# EAGLE design attiniest85-batty-shield-mk-2.2 (EAGLE 6.5.0)
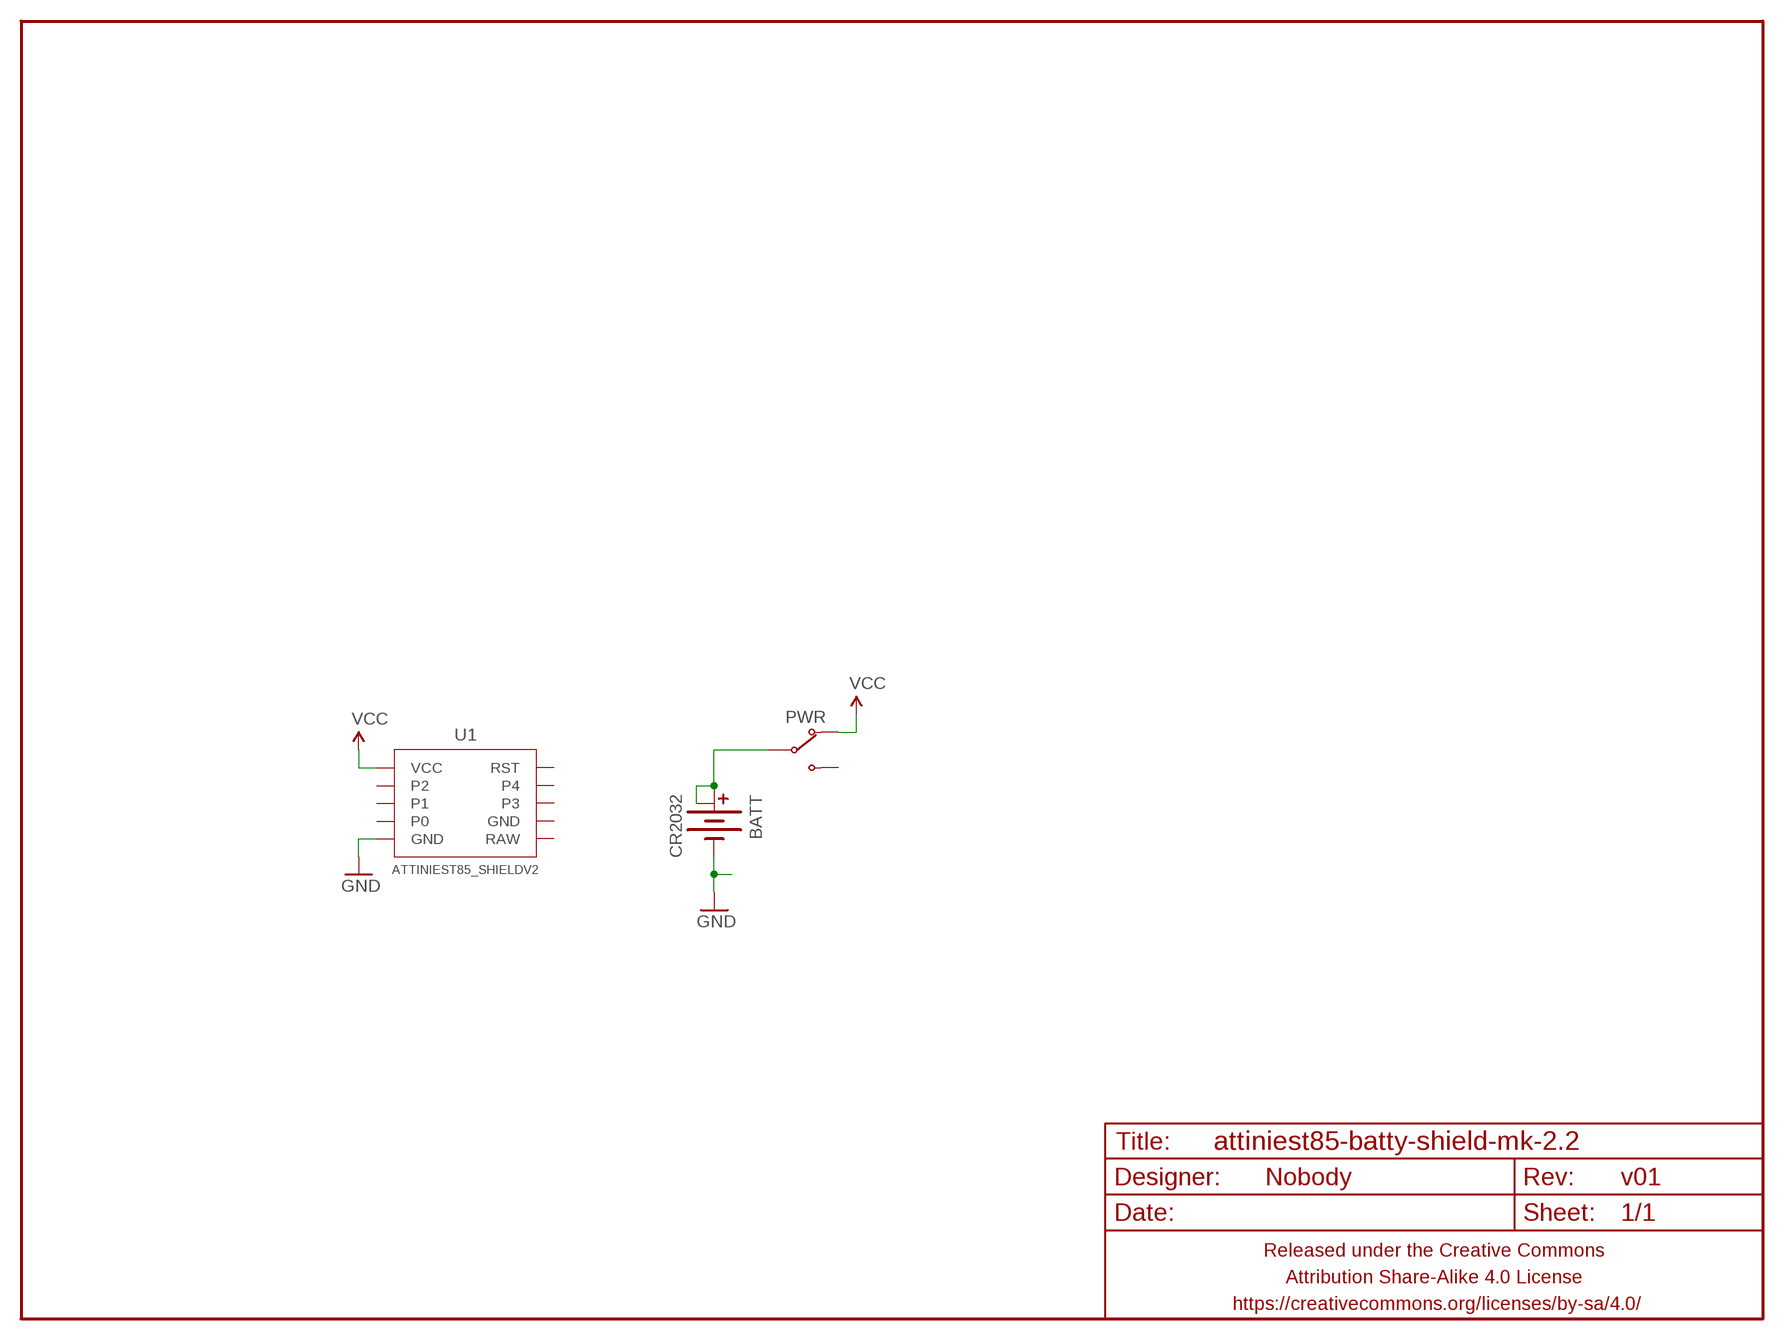
[diagram p0: schematic, sheet 1]

## Parts
BATT  CR2032  BATTERY-COINCR2032_SMD  [BATTCON_20MM_MINE]
FRAME1  FRAME-LETTERNO_PACKAGE  [DUMMY]
PWR  SWITCH-SPDTPTH-RA-2MM  [SPDT-RA-2MM]
U1  ATTINIEST85_SHIELDV2  [ATTINIEST85_SHIELD_V2]

## Nets
GND: BATT.BOTTOM(-) U1.GND@2(GND)
N$1: BATT.TOP@1(+) BATT.TOP@2(+1) PWR.2(COM)
VCC: PWR.1(NC) U1.VCC
Unconnected: PWR.3(NO) U1.0 U1.1 U1.2 U1.3 U1.4 U1.GND@1(GND) U1.RAW U1.RST

## Library data of the parts
BATT = A_butts:BATTERY-COIN
FRAME1 = A_butts:FRAME-LETTER: Schematic Frame Standard 8.5x11 US Letter frame; DESIGNER: Nobody; VERSION: v01
PWR = A_butts:SWITCH-SPDT
U1 = A_butts:ATTINIEST85_SHIELD

## Board
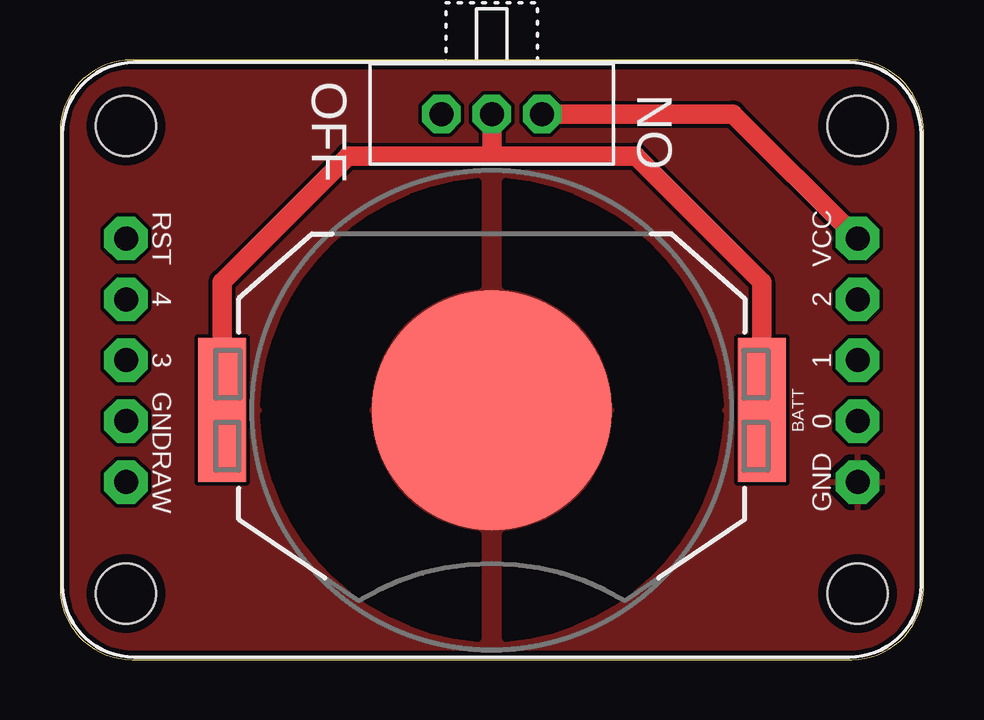
[diagram p1: board, top side]
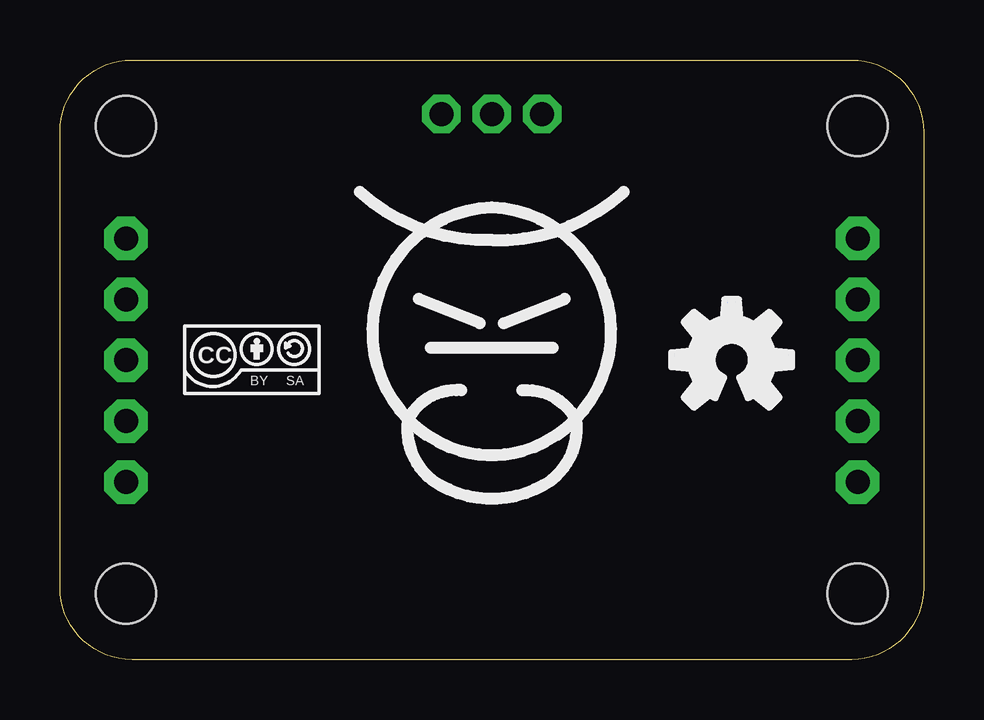
[diagram p2: board, bottom side, seen from below]

Size 36 x 25 mm. Coordinates in mm from the lower left corner, seen from the top.
Outline: 0,22 0,3 arc90 3,0 33,0 arc90 36,3 36,22 arc90 33,25 3,25 arc90 0,22
Copper layers (1*16): Top 0.0356mm / dielectric 1.5011mm / Bottom 0.0356mm
Design rules "LaenPCBOrder_2": minimum track width 6mil, minimum drill 13mil, track to track 6mil, track to pad 6mil, pad to pad 6mil, via to via 6mil, smd to smd 6mil, copper to edge 15mil, drill to drill 6mil, minimum pad ring 7mil, minimum via ring 7mil, stop-mask expansion 3mil, vias tented up to drill 20mil, thermal gap 10mil

### Footprints (pad centres in the part's own frame; a part is rotated, then mirrored left to right if it is on the bottom)
BATTCON_20MM_MINE = smd 10 x 10: BOTTOM 0,0 | smd 6 x 2: TOP@1 0,11.25; TOP@2 0,-11.25
SPDT-RA-2MM = drill 1 pad 1.6 octagon: 1 -2.1,0; 2 0,0; 3 2.1,0
ATTINIEST85_SHIELD_V2 = drill 1 pad 1.8 octagon: 0 15.25,-2.56; 1 15.25,-0.02; 2 15.25,2.52; 3 -15.25,-0.02; 4 -15.25,2.52; GND@1 -15.25,-2.56; GND@2 15.25,-5.1; RAW -15.25,-5.1; RST -15.25,5.06; VCC 15.25,5.06 | hole 2.5: -15.25,-9.75; -15.25,9.75; 15.25,9.75; 15.25,-9.75

### Placement (x,y rotation side)
BATT  18,10.4 270 top
FRAME1  0,0 0 top
PWR  18,22.75 180 top
U1  18,12.5 0 top
U$3  [CC-BY-SA-4.0-NO-URL]  28,12.5 0 bottom
U$4  [OSHWLOGO_TOP_0.2]  8,12.5 0 bottom
U$6  [COW_METAL]  18,12.5 0 bottom

### Tracks (layer width: path | path; a pad name or v marks a point on that pad's centre or on a via)
GND
  pour Top: -0.1,-0.1 -0.1,25.1 36.1,25.1 36.1,-0.1
N$1
  Top 0.813: BATT.TOP@2 6.75,15.75 12,21 18,21 | 18,21 24,21 29.25,15.75 BATT.TOP@1 | PWR.2 18,21
VCC
  Top 0.813: PWR.1 28.06,22.75 U1.VCC

### Text on the board
tPlace: OFF | ON